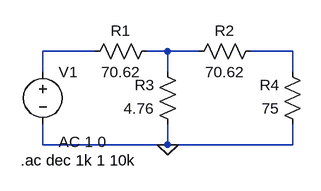
[diagram p0: schematic circuito_P1.asc]
circuito_P1.asc, the LTspice schematic file:
Version 4
SHEET 1 880 680
WIRE 80 80 0 80
WIRE 192 80 160 80
WIRE 240 80 192 80
WIRE 384 80 320 80
WIRE 0 112 0 80
WIRE 192 112 192 80
WIRE 384 112 384 80
WIRE 0 224 0 192
WIRE 192 224 192 192
WIRE 192 224 0 224
WIRE 384 224 384 192
WIRE 384 224 192 224
FLAG 192 224 0
SYMBOL voltage 0 96 R0
WINDOW 123 24 124 Left 2
WINDOW 39 0 0 Left 0
SYMATTR InstName V1
SYMATTR Value ""
SYMATTR Value2 AC 1 0
SYMBOL res 176 64 R90
WINDOW 0 0 56 VBottom 2
WINDOW 3 32 56 VTop 2
SYMATTR InstName R1
SYMATTR Value 70.62
SYMBOL res 336 64 R90
WINDOW 0 0 56 VBottom 2
WINDOW 3 32 56 VTop 2
SYMATTR InstName R2
SYMATTR Value 70.62
SYMBOL res 208 208 R180
WINDOW 0 36 76 Left 2
WINDOW 3 36 40 Left 2
SYMATTR InstName R3
SYMATTR Value 4.76
SYMBOL res 400 208 R180
WINDOW 0 36 76 Left 2
WINDOW 3 36 40 Left 2
SYMATTR InstName R4
SYMATTR Value 75
TEXT -34 248 Left 2 !.ac dec 1k 1 10k

The netlist it stands for:
* circuito_P1.asc
V1 N001 0 AC 1 0
R1 N002 N001 70.62
R2 N003 N002 70.62
R3 0 N002 4.76
R4 0 N003 75
.ac dec 1k 1 10k
.backanno
.end